# Altium project ((Inventory)).PrjPcb (part 1 of 4)
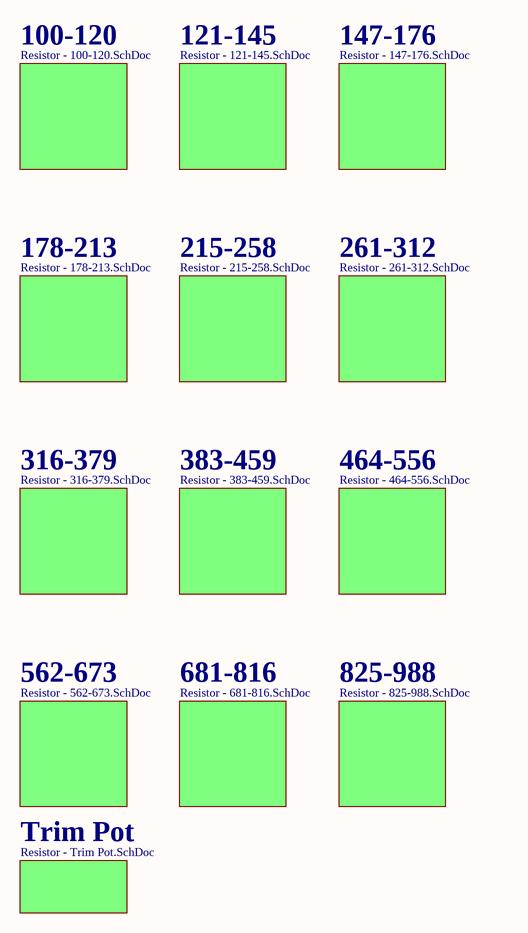
[diagram p0: Resistor.SchDoc]
37 sheets, 84 parts. Net scope: global (net labels, ports and power ports of the same name join across sheets).
Sheets:
  Resistor.SchDoc
    100-120 = Resistor - 100-120.SchDoc
    121-145 = Resistor - 121-145.SchDoc
    147-176 = Resistor - 147-176.SchDoc
    178-213 = Resistor - 178-213.SchDoc
    215-258 = Resistor - 215-258.SchDoc
    261-312 = Resistor - 261-312.SchDoc
    316-379 = Resistor - 316-379.SchDoc
    383-459 = Resistor - 383-459.SchDoc
    464-556 = Resistor - 464-556.SchDoc
    562-673 = Resistor - 562-673.SchDoc
    681-816 = Resistor - 681-816.SchDoc
    825-988 = Resistor - 825-988.SchDoc
    Trim Pot = Resistor - Trim Pot.SchDoc
  Capacitor - Ceramic.SchDoc
  Diode.SchDoc
    Rectifier = Diode - Rectifer.SchDoc
    Zener = Diode - Zener.SchDoc
    Schottky = Diode - Schottky.SchDoc
    TVS = Diode - TVS.SchDoc
    LED = Diode - Led.SchDoc
  Crystal.SchDoc
  Connector.SchDoc
    Header = Connector - Header.SchDoc
    JST = Connector - JST.SchDoc
    Registered Jack = Connector - Registered Jack.SchDoc
    USB = Connector - USB.SchDoc
  Transistor - BJT.SchDoc
  Transformer.SchDoc
  IC - Interface.SchDoc
  IC - MCU.SchDoc
  IC - Power - DC-DC.SchDoc
  IC - Buffer.SchDoc
  IC - Clock, Timing, Oscillator.SchDoc
  Mechanical.SchDoc
  Transistor - Mosfet.SchDoc
  Inductor.SchDoc

## Sheet Resistor.SchDoc
size A; SheetNumber: 1; SheetTotal: 14

### Sub-sheets
100-120 = Resistor - 100-120.SchDoc: no entries
121-145 = Resistor - 121-145.SchDoc: no entries
147-176 = Resistor - 147-176.SchDoc: no entries
178-213 = Resistor - 178-213.SchDoc: no entries
215-258 = Resistor - 215-258.SchDoc: no entries
261-312 = Resistor - 261-312.SchDoc: no entries
316-379 = Resistor - 316-379.SchDoc: no entries
383-459 = Resistor - 383-459.SchDoc: no entries
464-556 = Resistor - 464-556.SchDoc: no entries
562-673 = Resistor - 562-673.SchDoc: no entries
681-816 = Resistor - 681-816.SchDoc: no entries
825-988 = Resistor - 825-988.SchDoc: no entries
Trim Pot = Resistor - Trim Pot.SchDoc: no entries

## Sheet Resistor - 100-120.SchDoc
size A0; SheetNumber: 2; SheetTotal: 41
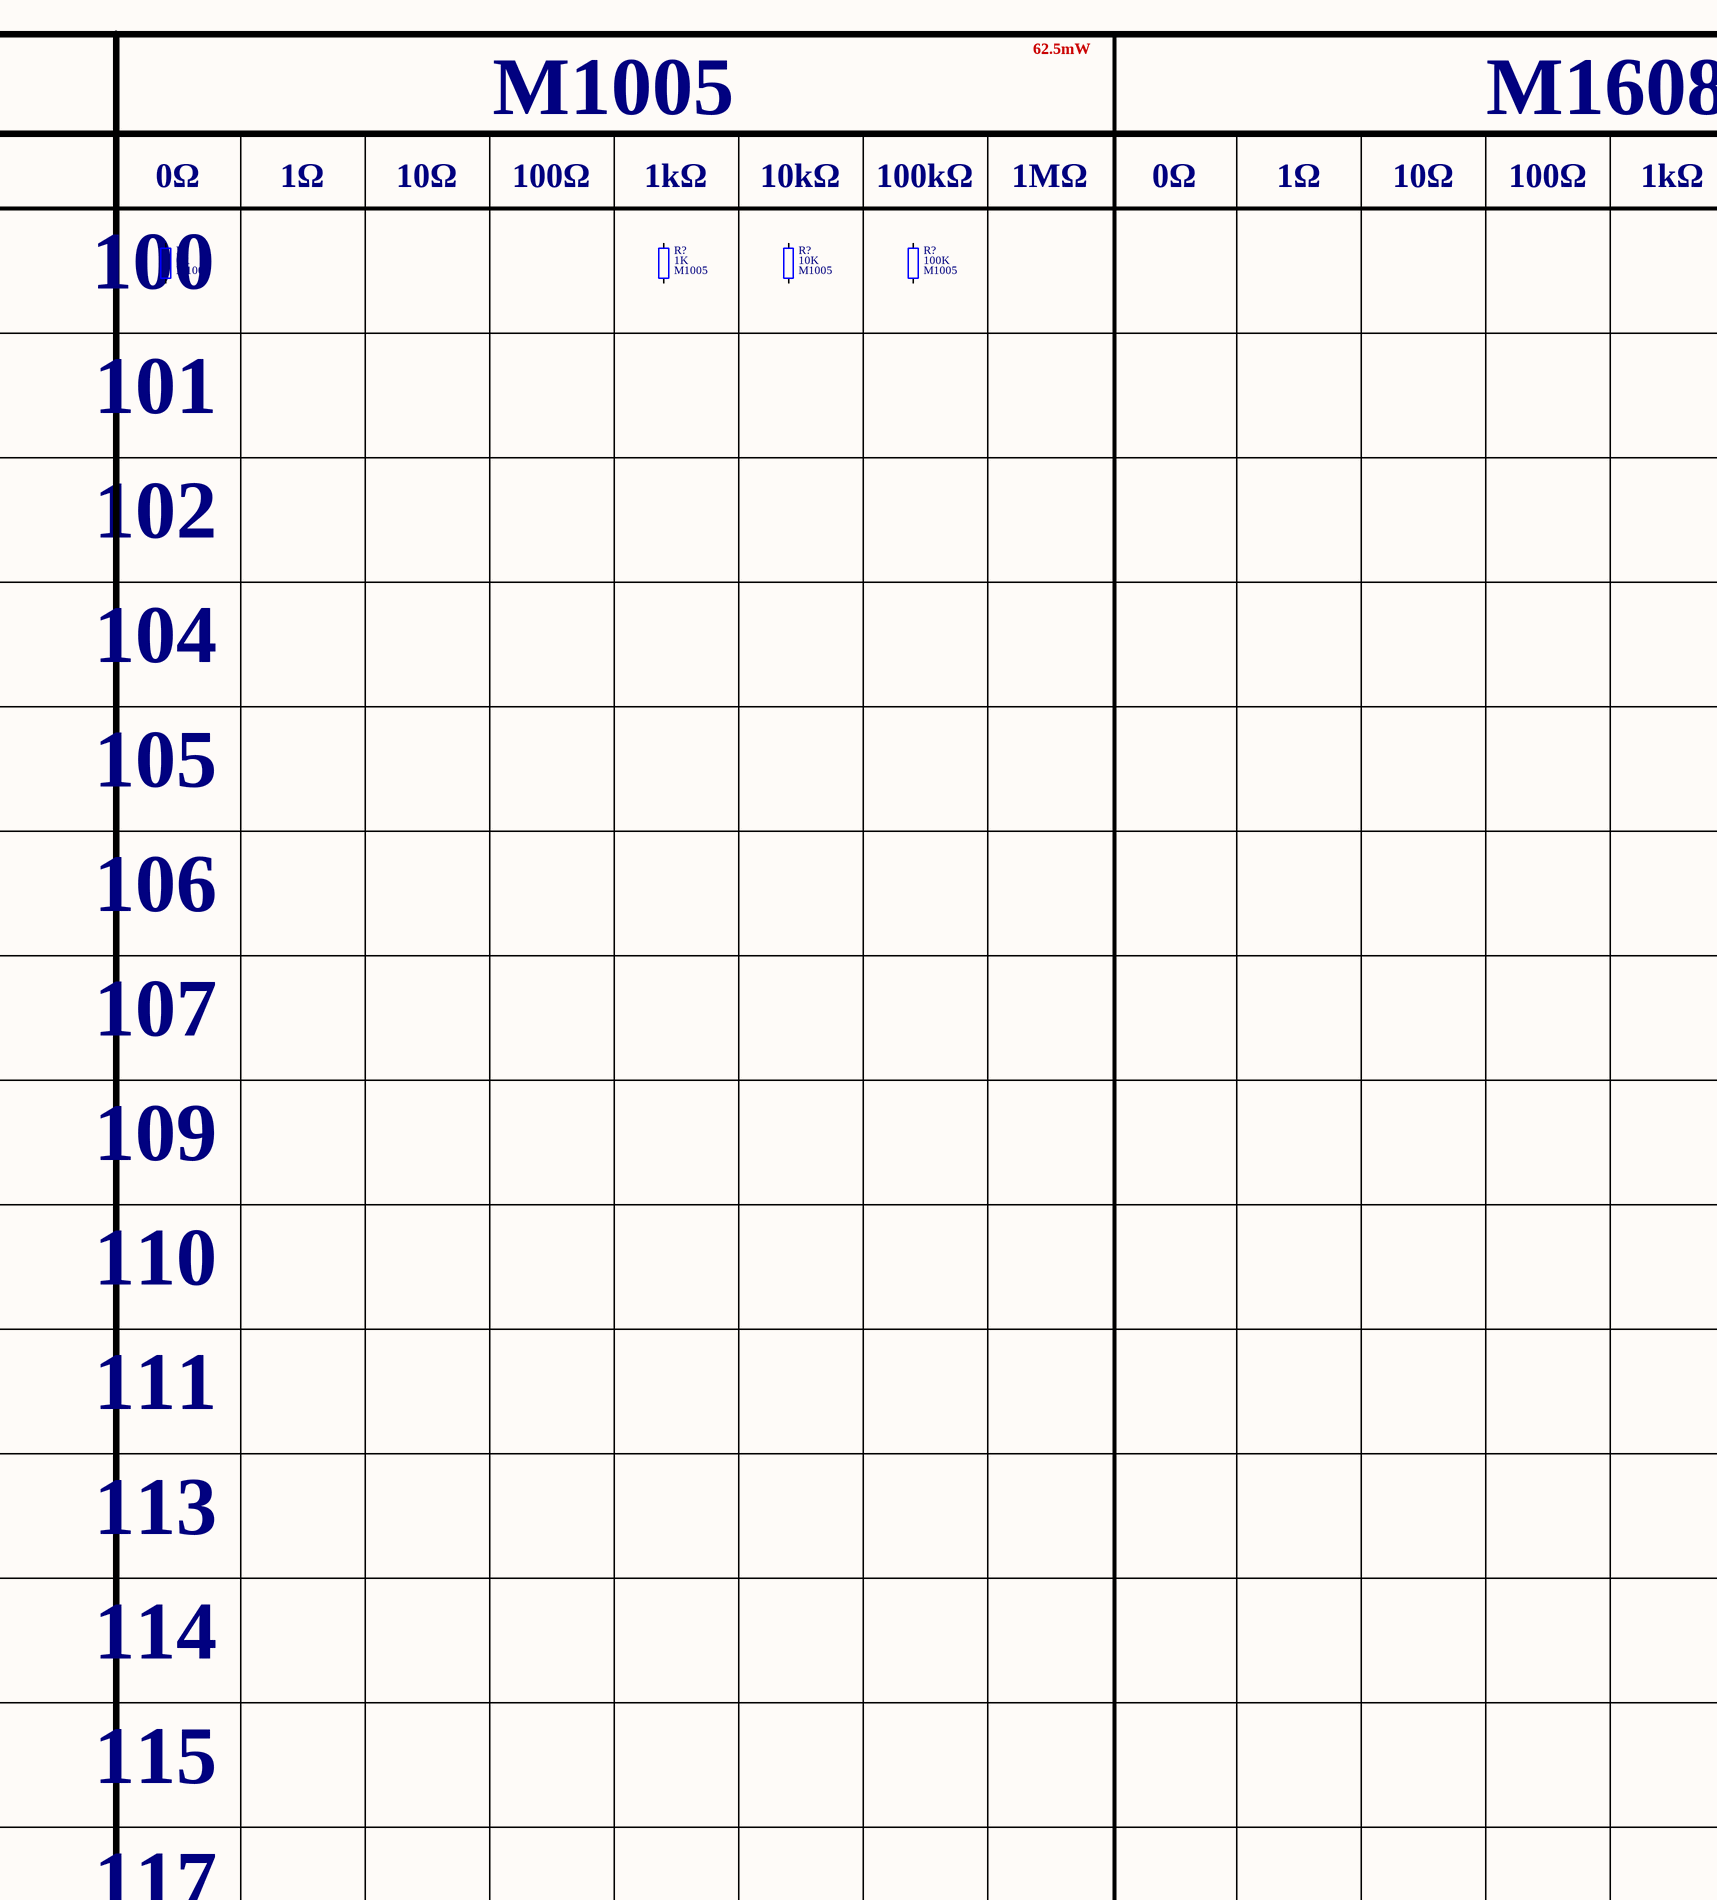
[diagram p1: Resistor - 100-120.SchDoc, top left]
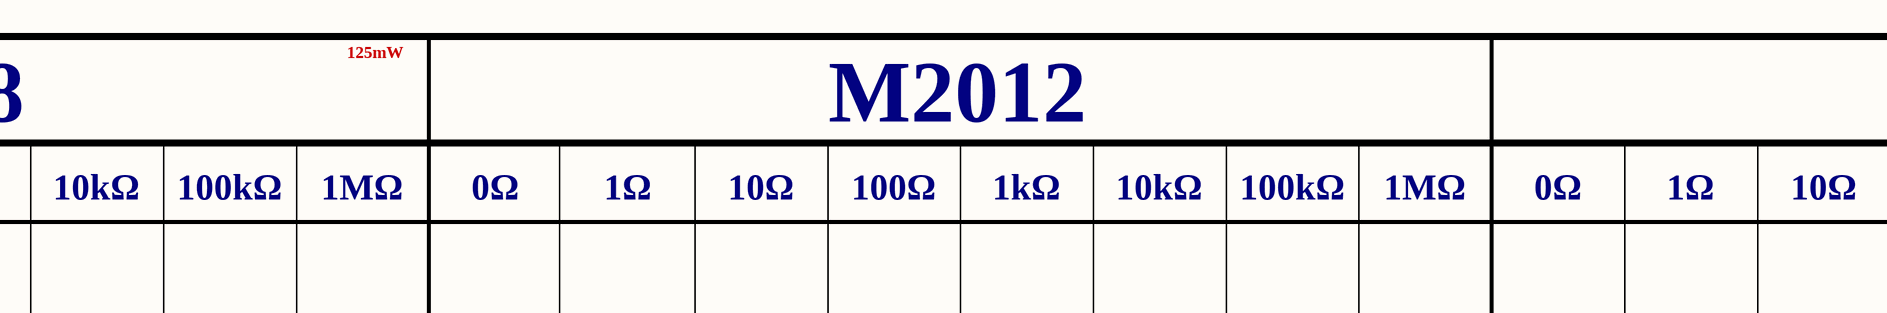
[diagram p2: Resistor - 100-120.SchDoc, top middle]
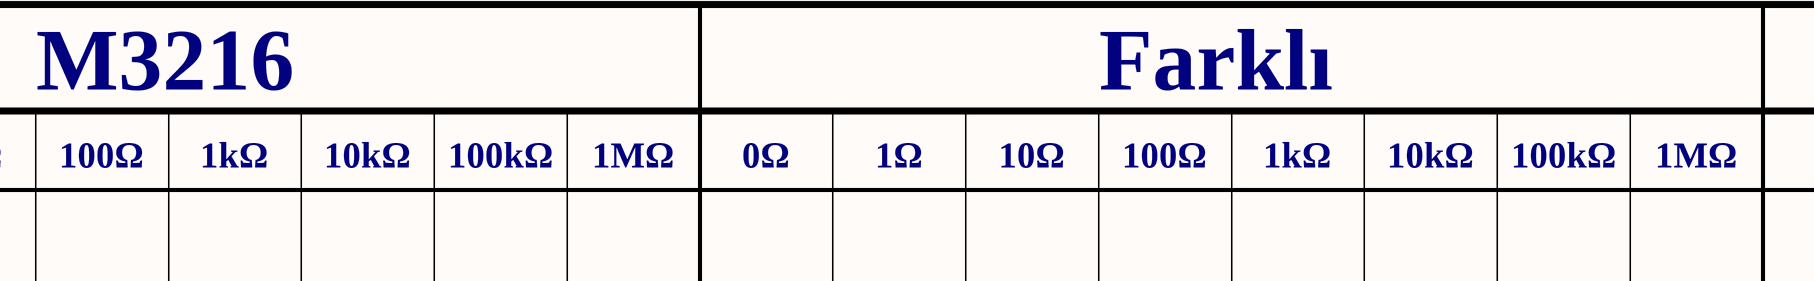
[diagram p3: Resistor - 100-120.SchDoc, top right]
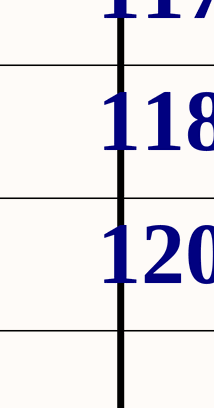
[diagram p4: Resistor - 100-120.SchDoc, bottom left]

### Parts
(Parts that share a designator on the sheet are numbered #1, #2 ... from top to bottom, then left to right.)
R?#1  value 0R  Package: M1005  [Resistor_Smd_M1005_I0402]  (hidden comment: Resistor)
R?#2  value 1K  Package: M1005  [Resistor_Smd_M1005_I0402]  (hidden comment: Resistor)
R?#3  value 10K  Package: M1005  [Resistor_Smd_M1005_I0402]  (hidden comment: Resistor)
R?#4  value 100K  Package: M1005  [Resistor_Smd_M1005_I0402]  (hidden comment: Resistor)

### Nets

Not connected (* = marked no-connect by the designer): R?#1 1 2; R?#2 1 2; R?#3 1 2; R?#4 1 2

### Notes on the sheet
- 62.5mW
- 125mW
- M1005
- M1608
- M2012
- M3216
- Farklı
- 0Ω
- 1Ω
- 10Ω
- 100Ω
- 1kΩ
- 10kΩ
- 100kΩ
- 1MΩ
- 100
- 101
- 102
- 104
- 105
- 106
- 107
- 109
- 110
- 111
- 113
- 114
- 115
- 117
- 118
- 120

### Library data of the parts
R?#1 = Resistor: Res, 0R, M1005; Manufacturer: Yageo; Manufacturer Part Number: RC0402FR-070RL; Component Category: Resistor; Component Type: Fixed Value; Tolerance: *; Supplier Link: https://www.digikey.com/en/products/detail/yageo/RC0402FR-070RL/2827570; Supplier Currency: $; Price, Max: 0.00109; Price, Min: 0.1; Quantity, Max: 50000; Quantity, Min: 1; Operating Temperature, Max: -55℃; Operating Temperature, Min: +155℃; Supplier Part Number: 311-0.0LRCT-ND; Supplier: Digikey; ComponentLink1Description: Datasheet; ComponentLink1URL: E:\Altium\Datasheets\Resistor\Yageo - RC_L Series.pdf; ComponentLink2Description: Supplier Link; ComponentLink2URL: https://www.digikey.com/en/products/detail/yageo/RC0402FR-070RL/2827570
R?#2 = Resistor: Res, 1K, 1%, M1005; Manufacturer: Yageo; Manufacturer Part Number: RC0402FR-071KP; Component Category: Resistor; Component Type: Fixed Value; Tolerance: 1%; Supplier Link: https://www.digikey.com/en/products/detail/yageo/RC0402FR-071KP/4935269; Supplier Currency: $; Price, Max: 0.00282; Price, Min: 0.1; Quantity, Max: 100000; Quantity, Min: 1; Operating Temperature, Max: -55℃; Operating Temperature, Min: +155℃; Supplier Part Number: YAG1254CT-ND; Supplier: Digikey; ComponentLink1Description: Datasheet; ComponentLink1URL: E:\Altium\Datasheets\Resistor\Yageo - RC_L Series.pdf; ComponentLink2Description: Supplier Link; ComponentLink2URL: https://www.digikey.com/en/products/detail/yageo/RC0402FR-071KP/4935269
R?#3 = Resistor: Res, 10K, 1%, M1005; Manufacturer: Yageo; Manufacturer Part Number: RC0402FR-0710KP; Component Category: Resistor; Component Type: Fixed Value; Tolerance: 1%; Supplier Link: https://www.digikey.com/en/products/detail/yageo/RC0402FR-0710KP/4935264; Supplier Currency: $; Price, Max: 0.00282; Price, Min: 0.1; Quantity, Max: 100000; Quantity, Min: 1; Operating Temperature, Max: -55℃; Operating Temperature, Min: +155℃; Supplier Part Number: YAG1249CT-ND; Supplier: Digikey; ComponentLink1Description: Datasheet; ComponentLink1URL: E:\Altium\Datasheets\Resistor\Yageo - RC_L Series.pdf; ComponentLink2Description: Supplier Link; ComponentLink2URL: https://www.digikey.com/en/products/detail/yageo/RC0402FR-0710KP/4935264
R?#4 = Resistor: Res, 100K, 1%, M1005; Manufacturer: Yageo; Manufacturer Part Number: RC0402FR-07100KP; Component Category: Resistor; Component Type: Fixed Value; Tolerance: 1%; Supplier Link: https://www.digikey.com/en/products/detail/yageo/RC0402FR-07100KP/12698883; Supplier Currency: $; Price, Max: 0.00282; Price, Min: 0.1; Quantity, Max: 100000; Quantity, Min: 1; Operating Temperature, Max: -55℃; Operating Temperature, Min: +155℃; Supplier Part Number: 13-RC0402FR-07100KPCT-ND; Supplier: Digikey; ComponentLink1Description: Datasheet; ComponentLink1URL: E:\Altium\Datasheets\Resistor\Yageo - RC_L Series.pdf; ComponentLink2Description: Supplier Link; ComponentLink2URL: https://www.digikey.com/en/products/detail/yageo/RC0402FR-07100KP/12698883

## Sheet Resistor - 121-145.SchDoc
size A0; SheetNumber: 3; SheetTotal: 14
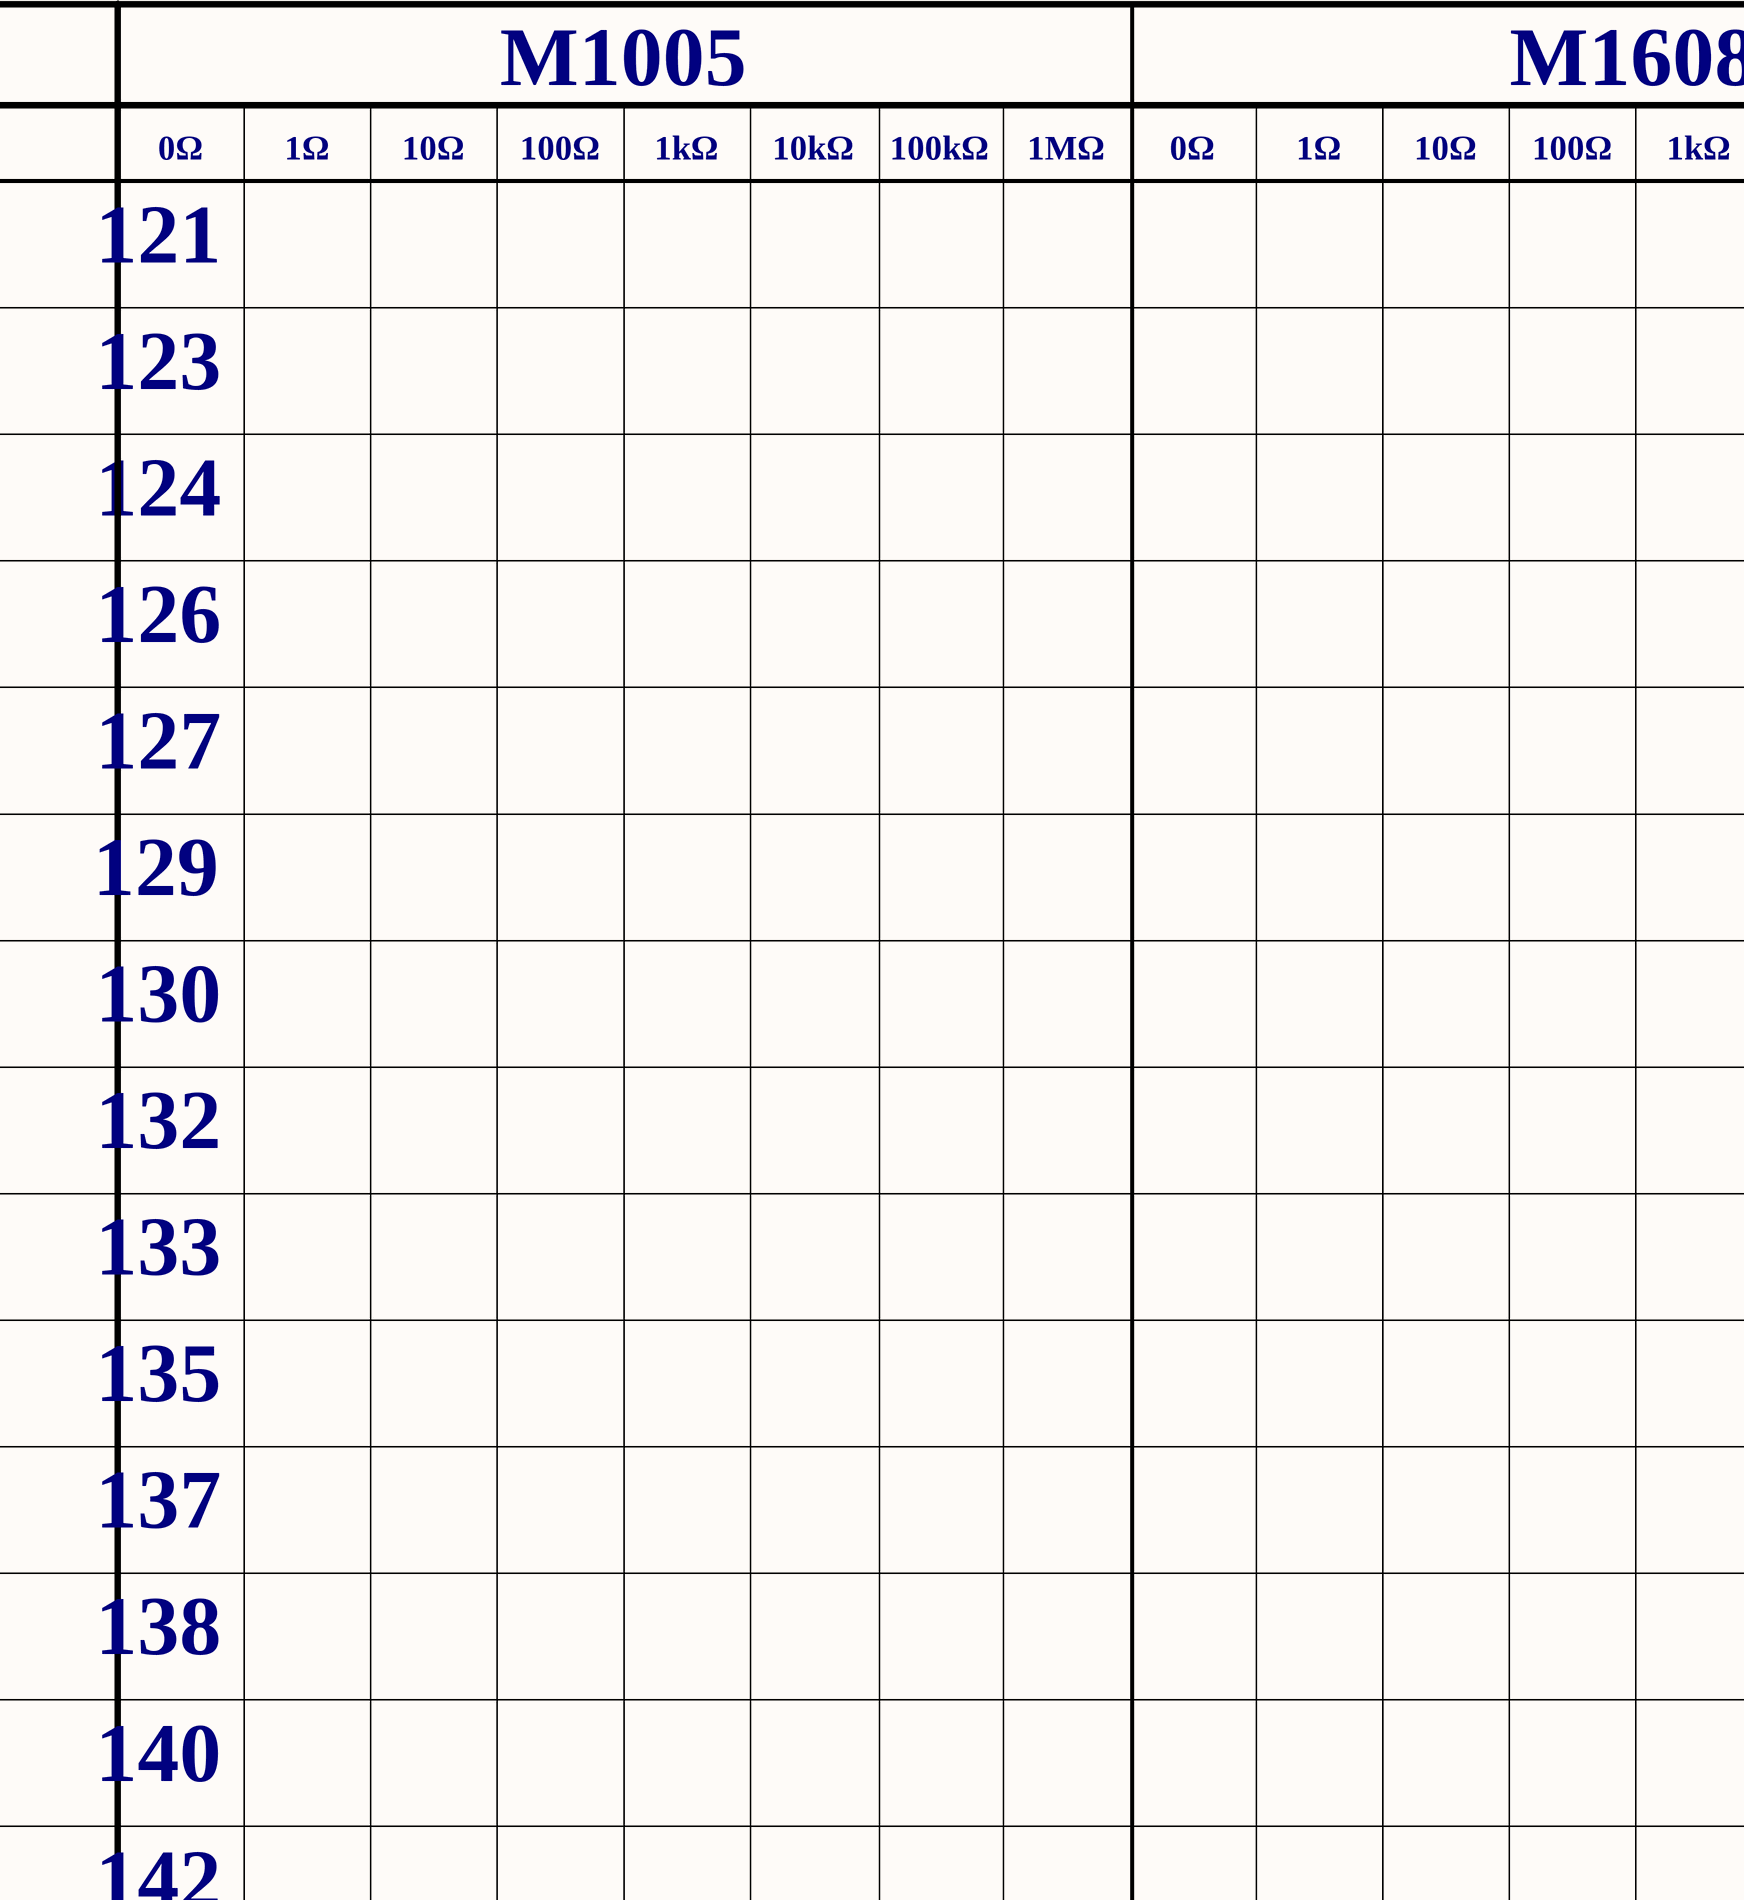
[diagram p5: Resistor - 121-145.SchDoc, top left]
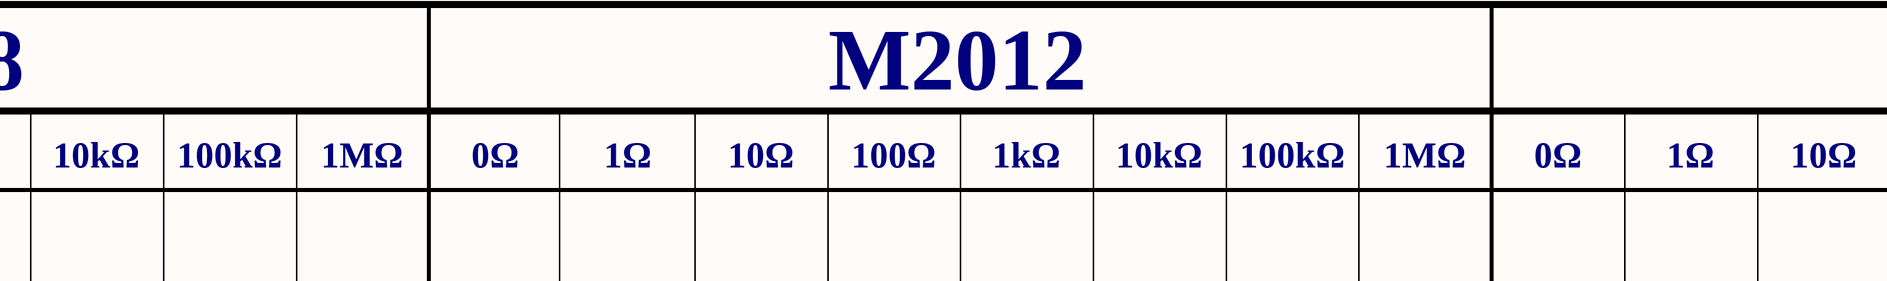
[diagram p6: Resistor - 121-145.SchDoc, top middle]
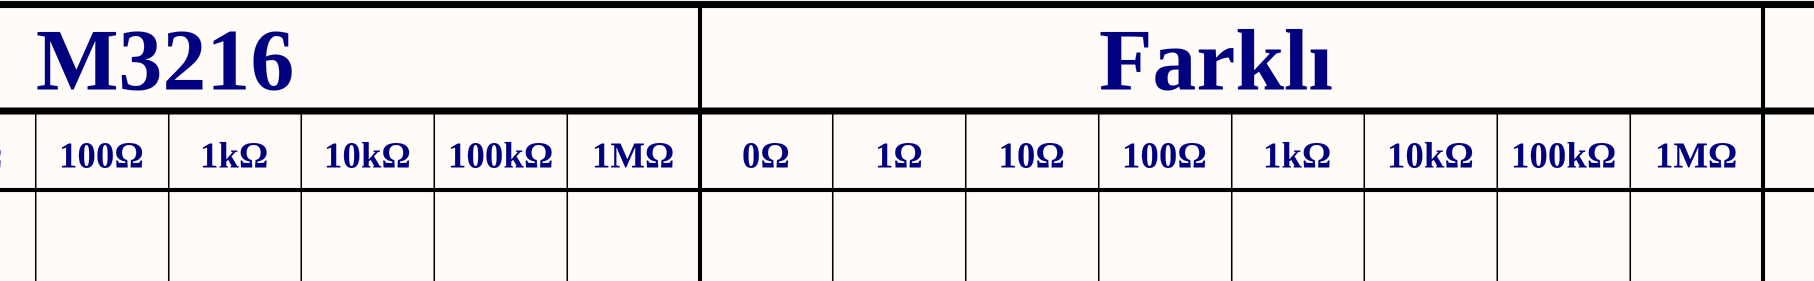
[diagram p7: Resistor - 121-145.SchDoc, top right]
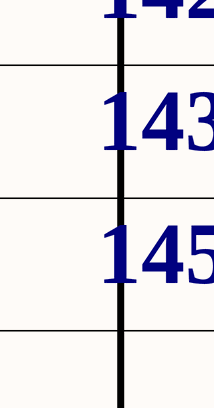
[diagram p8: Resistor - 121-145.SchDoc, bottom left]

### Notes on the sheet
- M1005
- M1608
- M2012
- M3216
- Farklı
- 0Ω
- 1Ω
- 10Ω
- 100Ω
- 1kΩ
- 10kΩ
- 100kΩ
- 1MΩ
- 121
- 123
- 124
- 126
- 127
- 129
- 130
- 132
- 133
- 135
- 137
- 138
- 140
- 142
- 143
- 145

## Sheet Resistor - 147-176.SchDoc
size A0; SheetNumber: 4; SheetTotal: 41
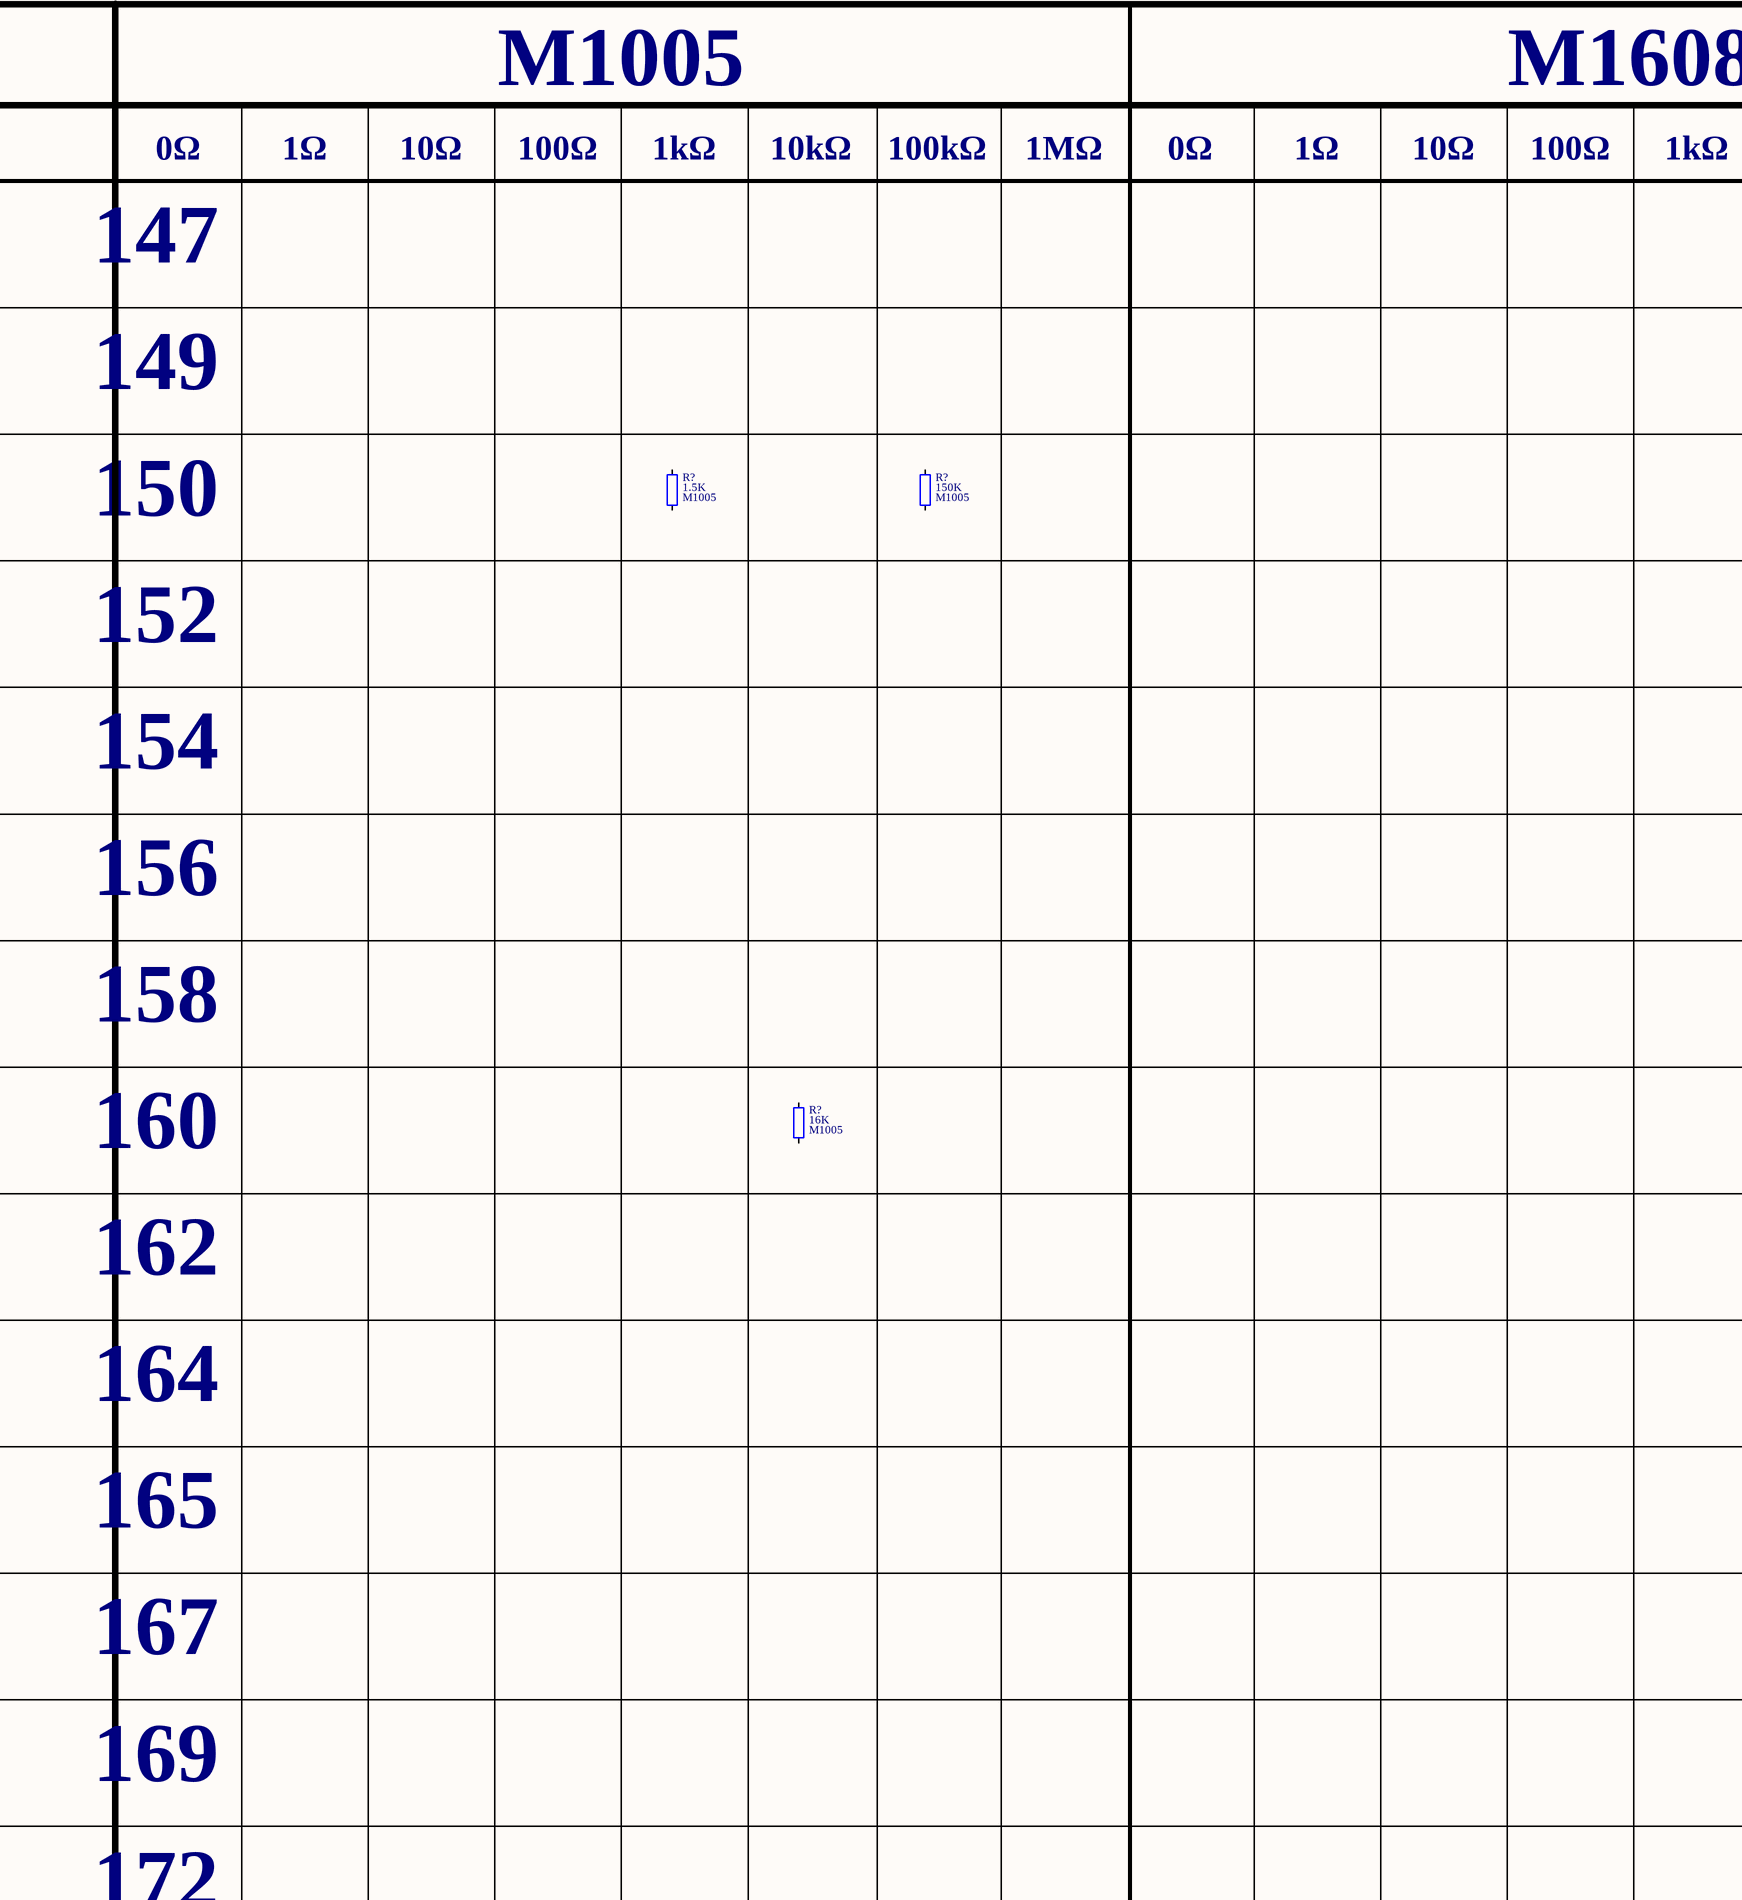
[diagram p9: Resistor - 147-176.SchDoc, top left]
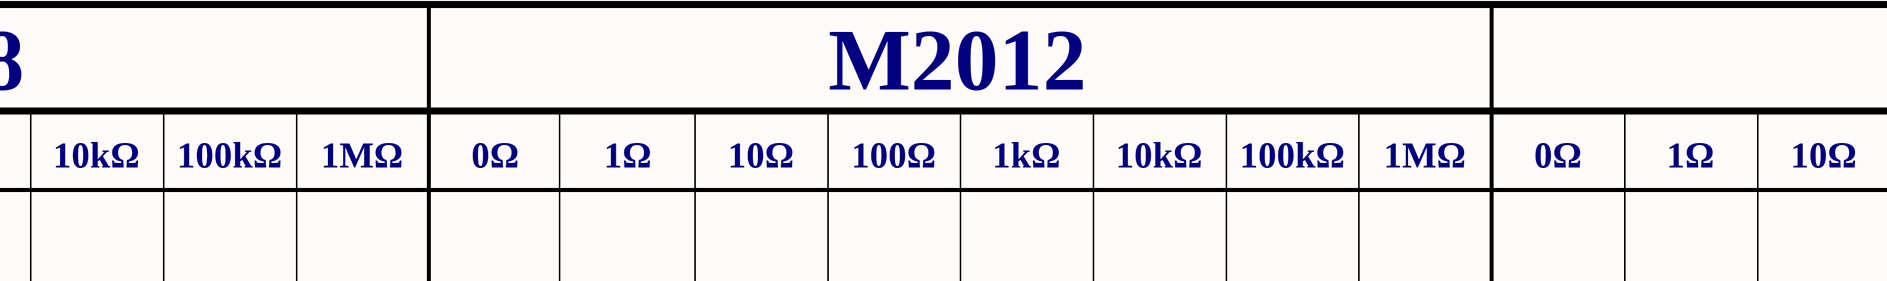
[diagram p10: Resistor - 147-176.SchDoc, top middle]
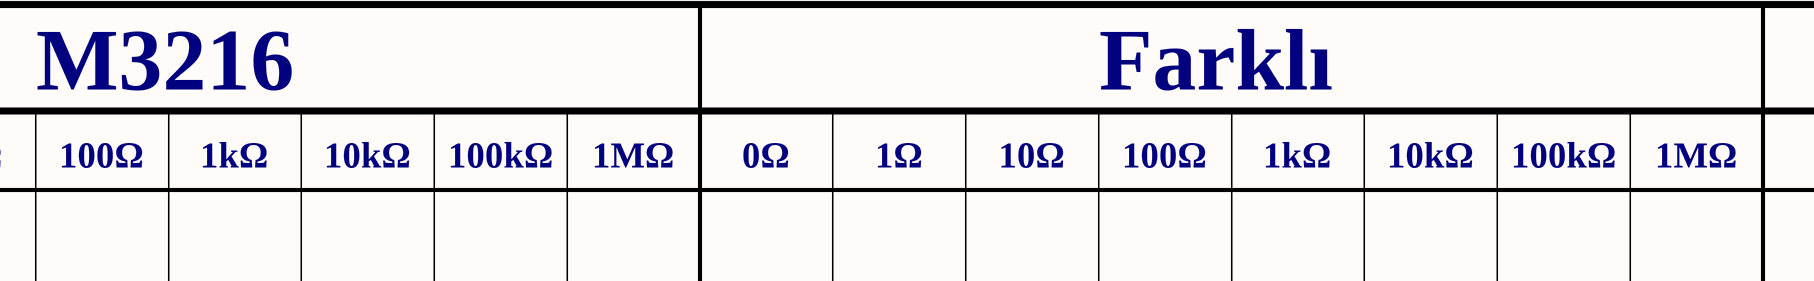
[diagram p11: Resistor - 147-176.SchDoc, top right]
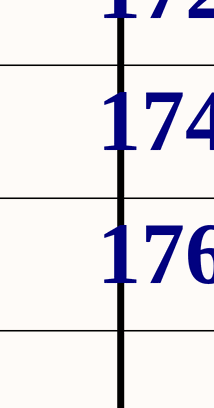
[diagram p12: Resistor - 147-176.SchDoc, bottom left]

### Parts
(Parts that share a designator on the sheet are numbered #1, #2 ... from top to bottom, then left to right.)
R?#5  value 1.5K  Package: M1005  [Resistor_Smd_M1005_I0402]  (hidden comment: Resistor)
R?#6  value 150K  Package: M1005  [Resistor_Smd_M1005_I0402]  (hidden comment: Resistor)
R?#7  value 16K  Package: M1005  [Resistor_Smd_M1005_I0402]  (hidden comment: Resistor)

### Nets

Not connected (* = marked no-connect by the designer): R?#5 1 2; R?#6 1 2; R?#7 1 2

### Notes on the sheet
- M1005
- M1608
- M2012
- M3216
- Farklı
- 0Ω
- 1Ω
- 10Ω
- 100Ω
- 1kΩ
- 10kΩ
- 100kΩ
- 1MΩ
- 147
- 149
- 150
- 152
- 154
- 156
- 158
- 160
- 162
- 164
- 165
- 167
- 169
- 172
- 174
- 176

### Library data of the parts
R?#5 = Resistor: Res, 1.5K, 1%, M1005; Manufacturer: Yageo; Manufacturer Part Number: RC0402FR-071K5L; Component Category: Resistor; Component Type: Fixed Value; Tolerance: 1%; Supplier Link: https://www.digikey.com/en/products/detail/yageo/RC0402FR-071K5L/726519; Supplier Currency: $; Price, Max: 0.00129; Price, Min: 0.1; Quantity, Max: 100000; Quantity, Min: 1; Operating Temperature, Max: -55℃; Operating Temperature, Min: +155℃; Supplier Part Number: 311-1.50KLRCT-ND; Supplier: Digikey; ComponentLink1Description: Datasheet; ComponentLink1URL: E:\Altium\Datasheets\Resistor\Yageo - RC_L Series.pdf; ComponentLink2Description: Supplier Link; ComponentLink2URL: https://www.digikey.com/en/products/detail/yageo/RC0402FR-071K5L/726519
R?#6 = Resistor: Res, 150K, 1%, M1005; Manufacturer: Yageo; Manufacturer Part Number: RC0402FR-07150KL; Component Category: Resistor; Component Type: Fixed Value; Tolerance: 1%; Supplier Link: https://www.digikey.com/en/products/detail/yageo/RC0402FR-07150KL/726542; Supplier Currency: $; Price, Max: 0.00129; Price, Min: 0.1; Quantity, Max: 100000; Quantity, Min: 1; Operating Temperature, Max: -55℃; Operating Temperature, Min: +155℃; Supplier Part Number: 311-150KLRCT-ND; Supplier: Digikey; ComponentLink1Description: Datasheet; ComponentLink1URL: E:\Altium\Datasheets\Resistor\Yageo - RC_L Series.pdf; ComponentLink2Description: Supplier Link; ComponentLink2URL: https://www.digikey.com/en/products/detail/yageo/RC0402FR-07150KL/726542
R?#7 = Resistor: Res, 16K, 1%, M1005; Manufacturer: Yageo; Manufacturer Part Number: RC0402FR-0716KL; Component Category: Resistor; Component Type: Fixed Value; Tolerance: 1%; Supplier Link: https://www.digikey.com/en/products/detail/yageo/RC0402FR-0716KL/726544; Supplier Currency: $; Price, Max: 0.00129; Price, Min: 0.1; Quantity, Max: 100000; Quantity, Min: 1; Operating Temperature, Max: -55℃; Operating Temperature, Min: +155℃; Supplier Part Number: 311-16.0KLRCT-ND; Supplier: Digikey; ComponentLink1Description: Datasheet; ComponentLink1URL: E:\Altium\Datasheets\Resistor\Yageo - RC_L Series.pdf; ComponentLink2Description: Supplier Link; ComponentLink2URL: https://www.digikey.com/en/products/detail/yageo/RC0402FR-0716KL/726544

## Sheet Resistor - 178-213.SchDoc
size A0; SheetNumber: 5; SheetTotal: 41
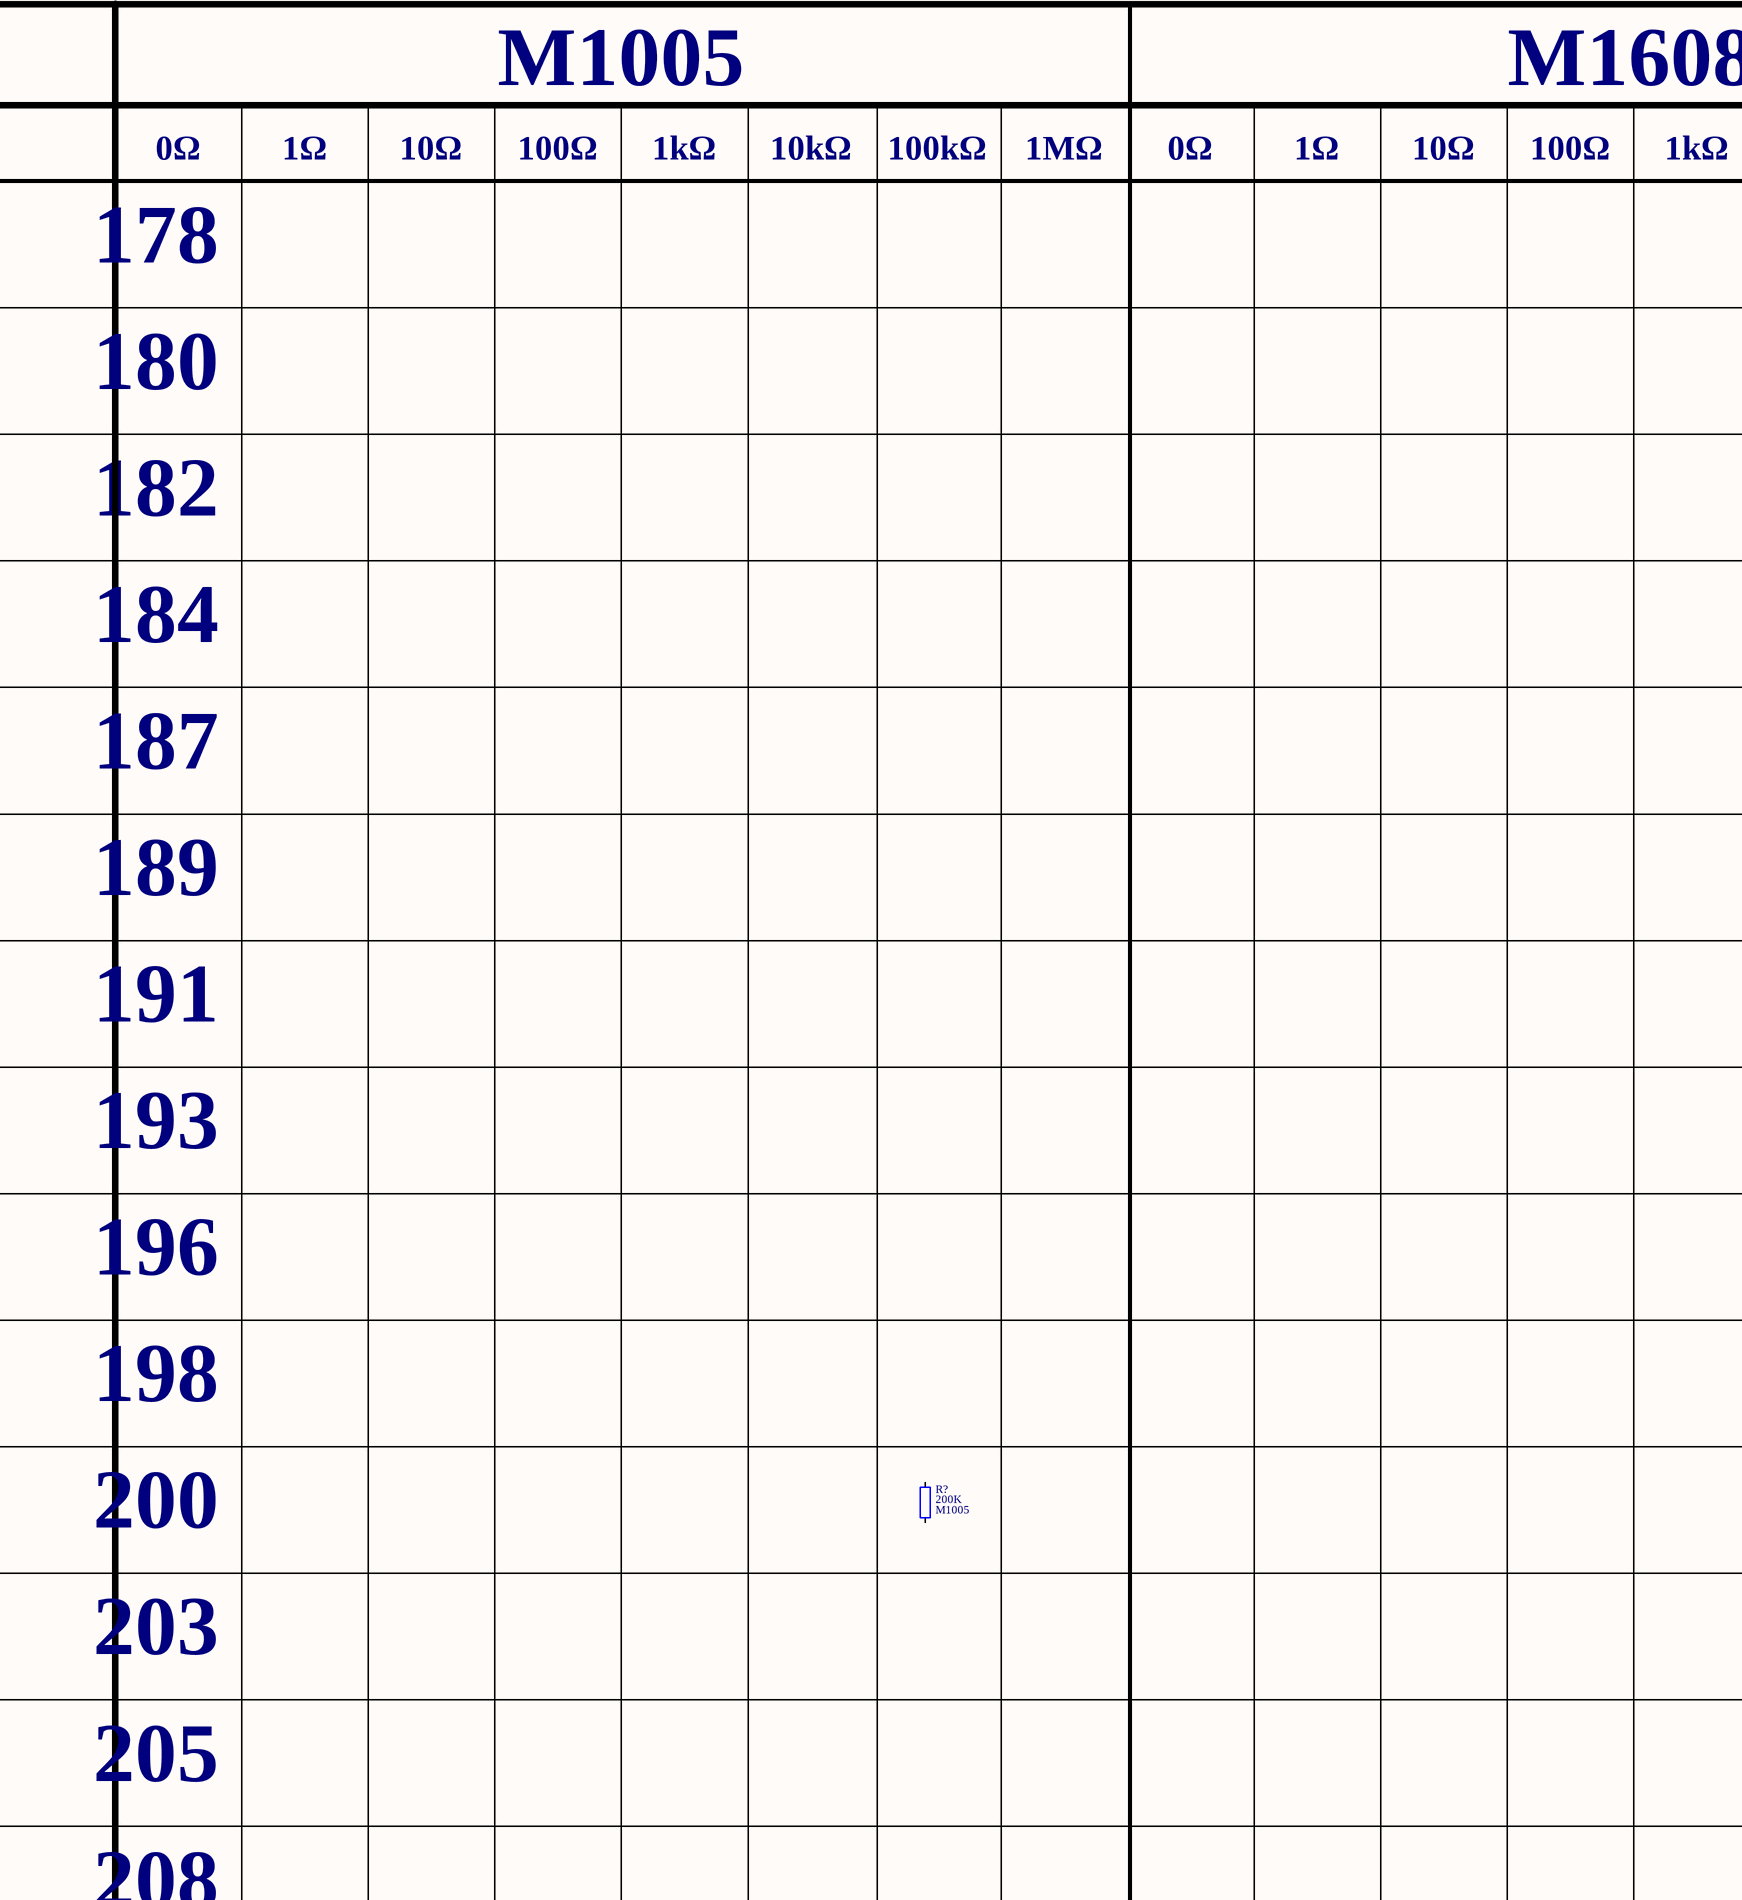
[diagram p13: Resistor - 178-213.SchDoc, top left]
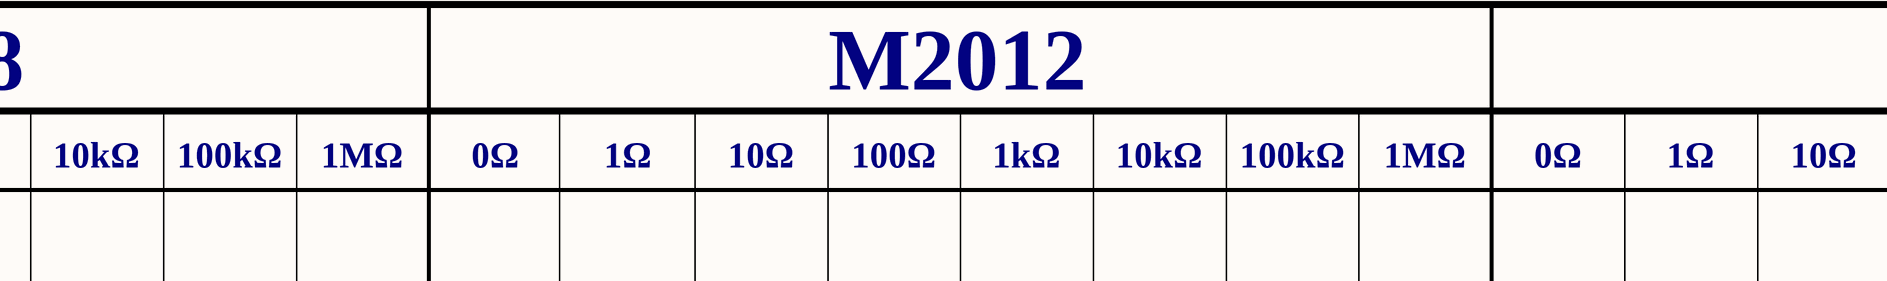
[diagram p14: Resistor - 178-213.SchDoc, top middle]
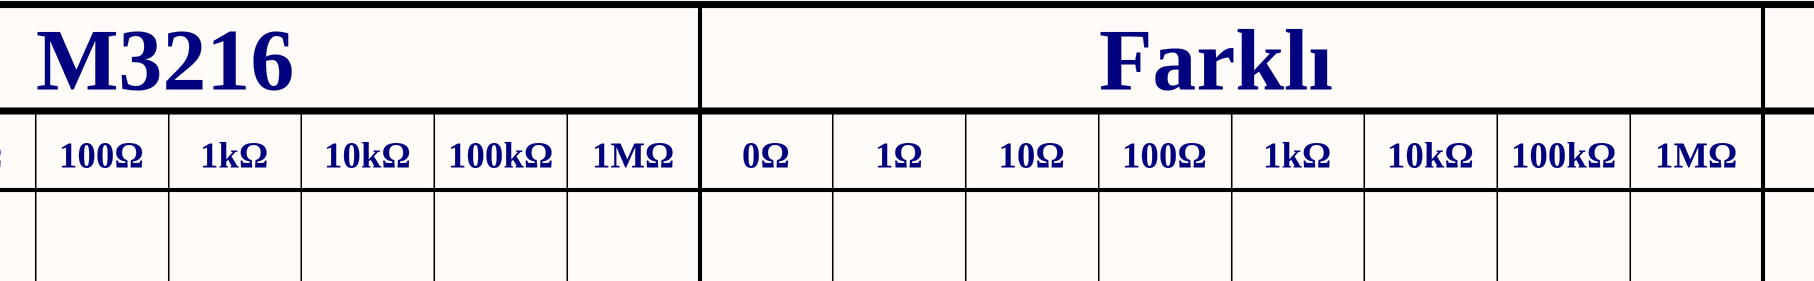
[diagram p15: Resistor - 178-213.SchDoc, top right]
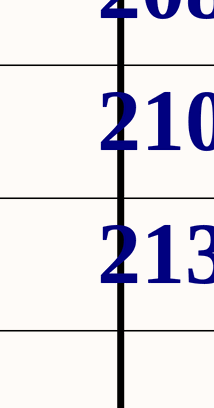
[diagram p16: Resistor - 178-213.SchDoc, bottom left]

### Parts
(Parts that share a designator on the sheet are numbered #1, #2 ... from top to bottom, then left to right.)
R?#8  value 200K  Package: M1005  [Resistor_Smd_M1005_I0402]  (hidden comment: Resistor)

### Nets

Not connected (* = marked no-connect by the designer): R?#8 1 2

### Notes on the sheet
- M1005
- M1608
- M2012
- M3216
- Farklı
- 0Ω
- 1Ω
- 10Ω
- 100Ω
- 1kΩ
- 10kΩ
- 100kΩ
- 1MΩ
- 178
- 180
- 182
- 184
- 187
- 189
- 191
- 193
- 196
- 198
- 200
- 203
- 205
- 208
- 210
- 213

### Library data of the parts
R?#8 = Resistor: Res, 200K, 1%, M1005; Manufacturer: Yageo; Manufacturer Part Number: RC0402FR-07200KL; Component Category: Resistor; Component Type: Fixed Value; Tolerance: 1%; Supplier Link: https://www.digikey.com/en/products/detail/yageo/RC0402FR-07200KL/726558; Supplier Currency: $; Price, Max: 0.00129; Price, Min: 0.1; Quantity, Max: 100000; Quantity, Min: 1; Operating Temperature, Max: -55℃; Operating Temperature, Min: +155℃; Supplier Part Number: 311-200KLRCT-ND; Supplier: Digikey; ComponentLink1Description: Datasheet; ComponentLink1URL: E:\Altium\Datasheets\Resistor\Yageo - RC_L Series.pdf; ComponentLink2Description: Supplier Link; ComponentLink2URL: https://www.digikey.com/en/products/detail/yageo/RC0402FR-07200KL/726558

## Sheet Resistor - 215-258.SchDoc
size A0; SheetNumber: 6; SheetTotal: 41
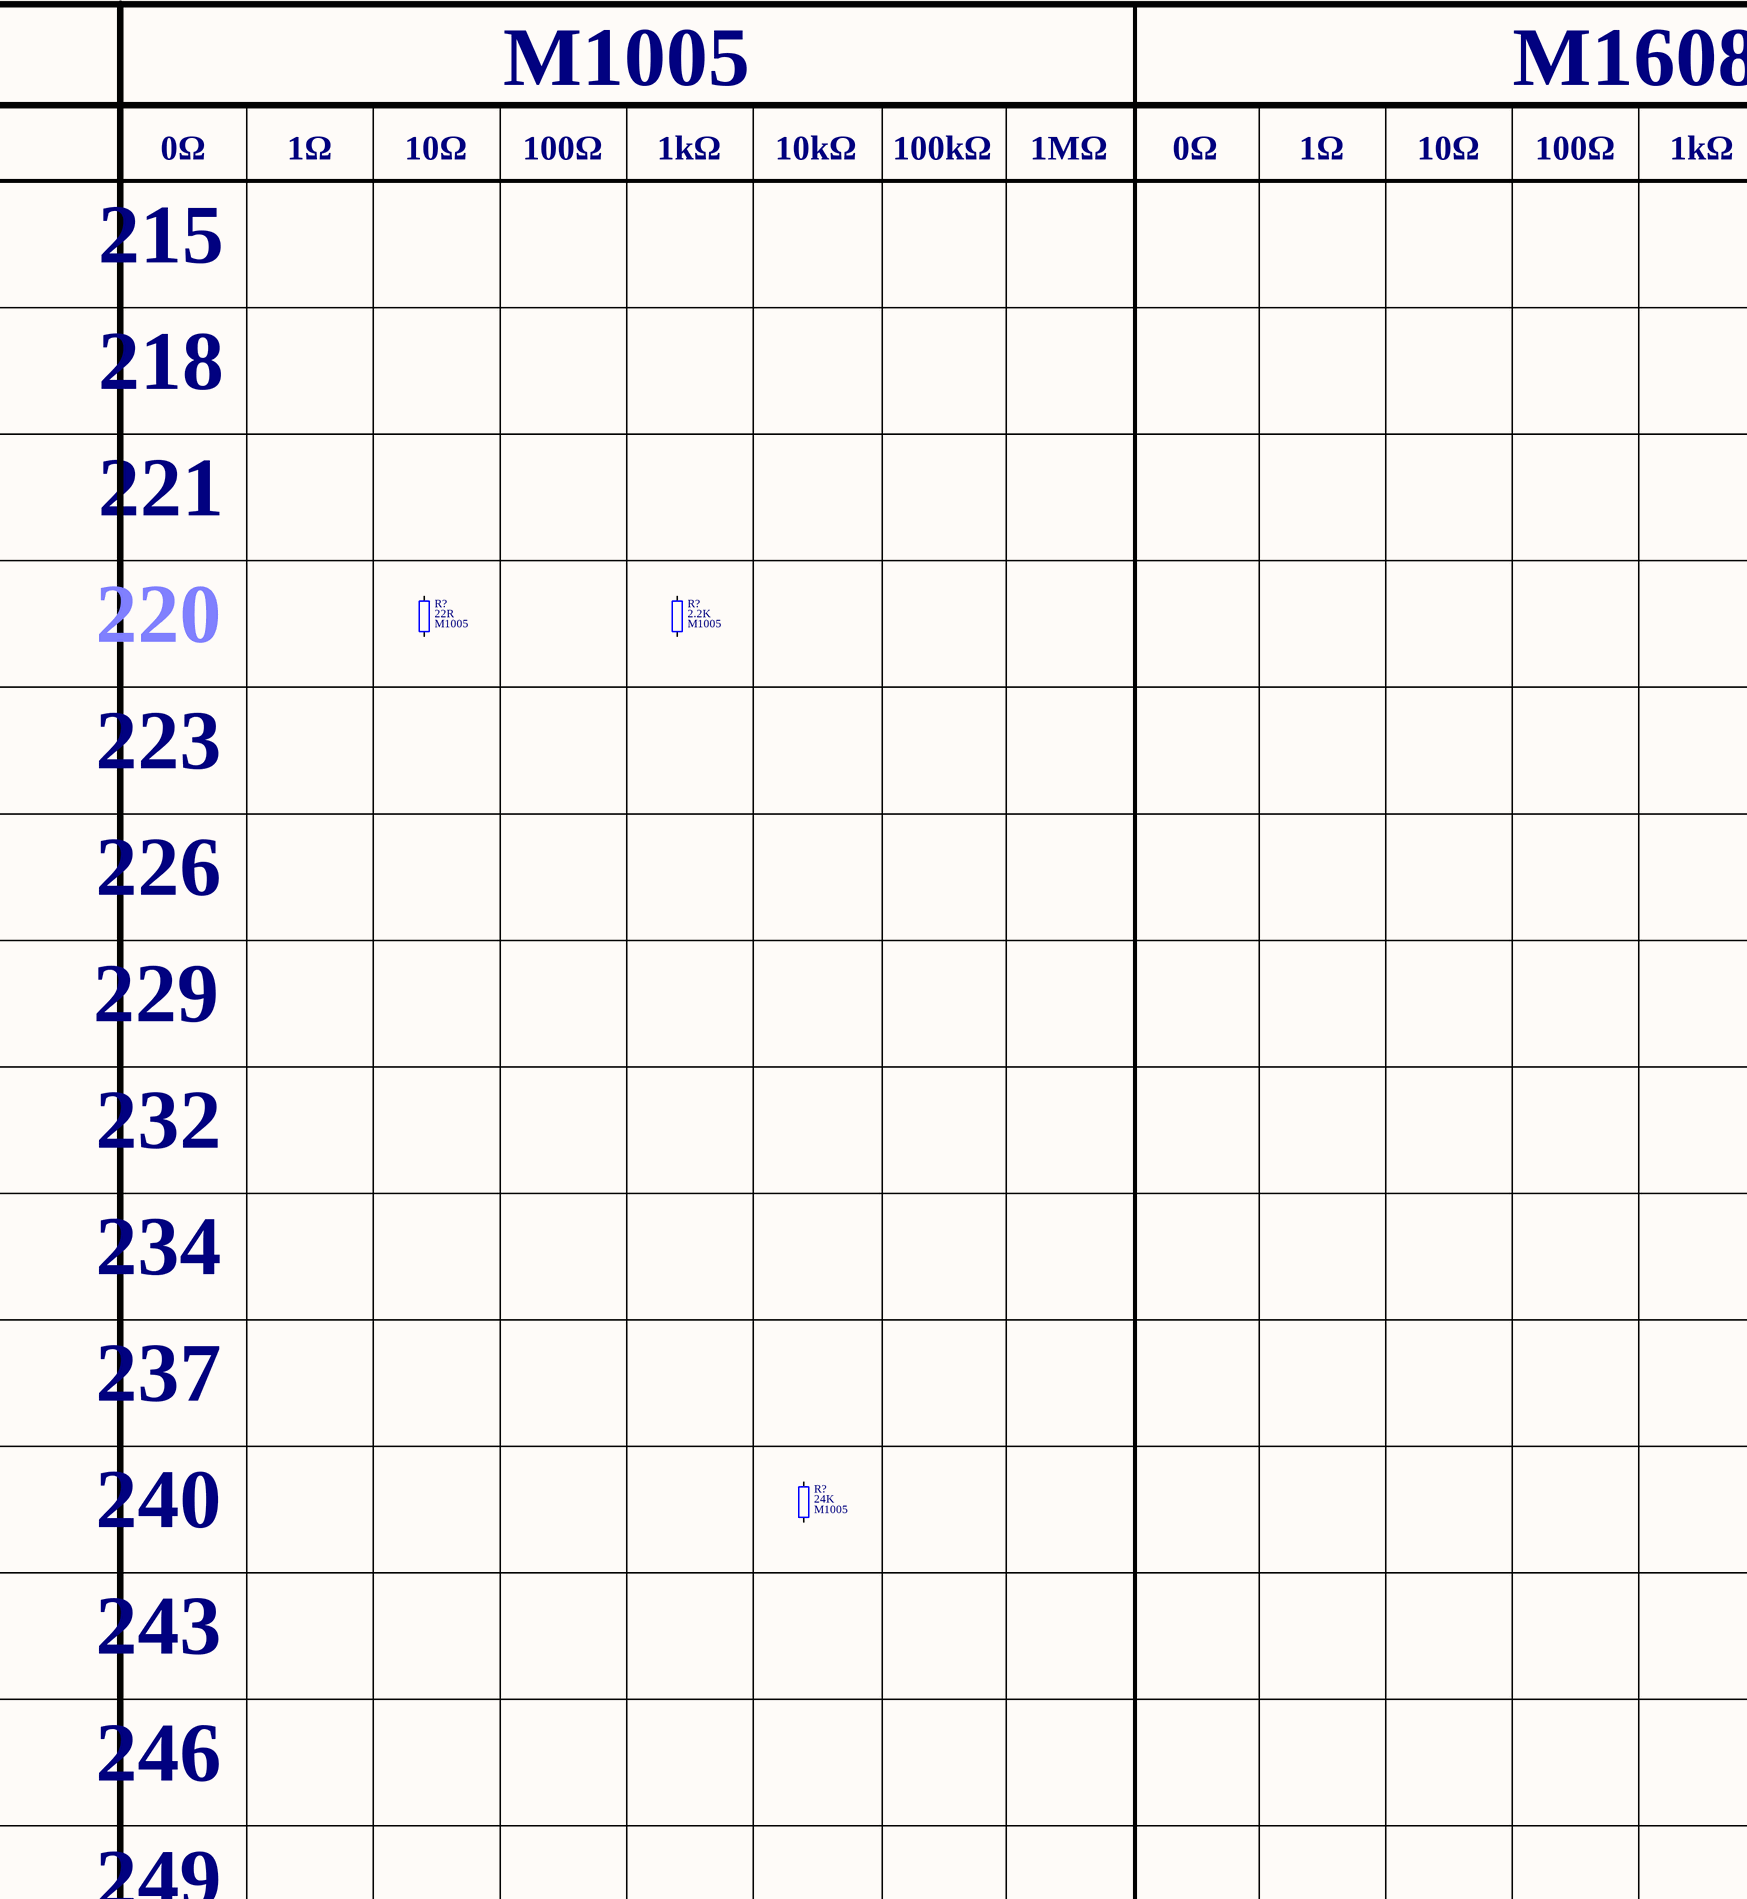
[diagram p17: Resistor - 215-258.SchDoc, top left]
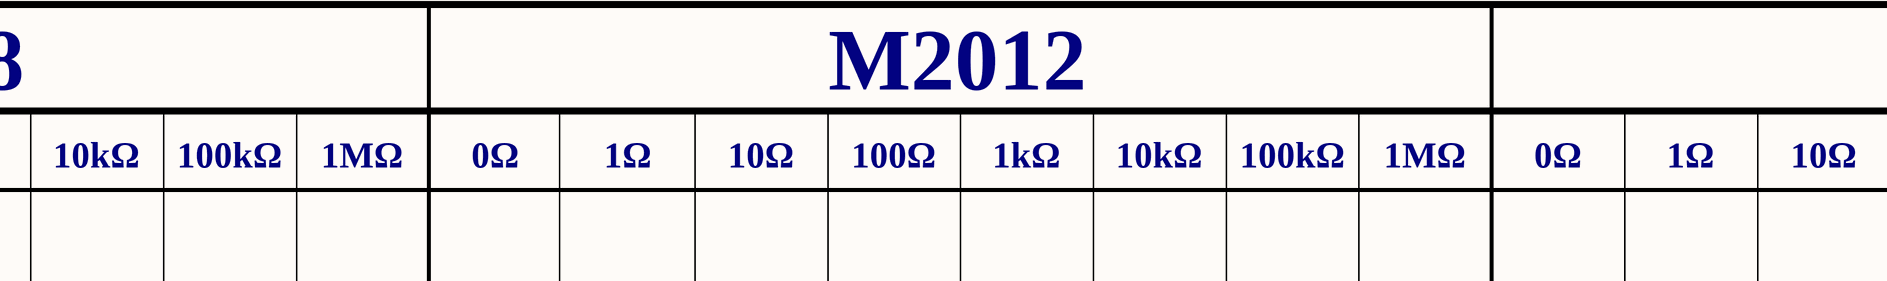
[diagram p18: Resistor - 215-258.SchDoc, top middle]
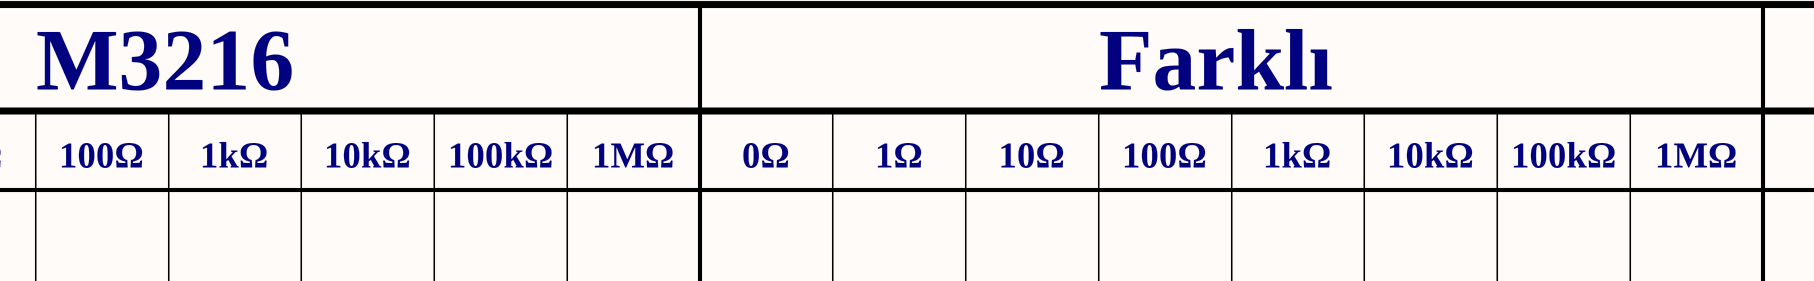
[diagram p19: Resistor - 215-258.SchDoc, top right]
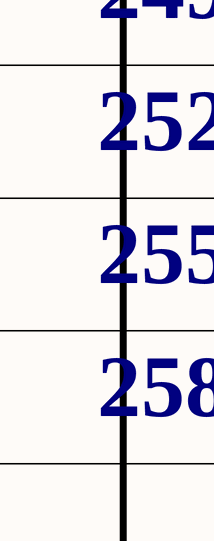
[diagram p20: Resistor - 215-258.SchDoc, bottom left]

### Parts
(Parts that share a designator on the sheet are numbered #1, #2 ... from top to bottom, then left to right.)
R?#9  value 22R  Package: M1005  [Resistor_Smd_M1005_I0402]  (hidden comment: Resistor)
R?#10  value 2.2K  Package: M1005  [Resistor_Smd_M1005_I0402]  (hidden comment: Resistor)
R?#11  value 24K  Package: M1005  [Resistor_Smd_M1005_I0402]  (hidden comment: Resistor)

### Nets

Not connected (* = marked no-connect by the designer): R?#9 1 2; R?#10 1 2; R?#11 1 2

### Notes on the sheet
- M1005
- M1608
- M2012
- M3216
- Farklı
- 0Ω
- 1Ω
- 10Ω
- 100Ω
- 1kΩ
- 10kΩ
- 100kΩ
- 1MΩ
- 215
- 218
- 221
- 220
- 223
- 226
- 229
- 232
- 234
- 237
- 240
- 243
- 246
- 249
- 252
- 255
- 258

### Library data of the parts
R?#9 = Resistor: Res, 22R, 1%, M1005; Manufacturer: Yageo; Manufacturer Part Number: RC0402FR-0722RL; Component Category: Resistor; Component Type: Fixed Value; Tolerance: 1%; Supplier Link: https://www.digikey.com/en/products/detail/yageo/RC0402FR-0722RL/726562; Supplier Currency: $; Price, Max: 0.00129; Price, Min: 0.1; Quantity, Max: 100000; Quantity, Min: 1; Operating Temperature, Max: -55℃; Operating Temperature, Min: +155℃; Supplier Part Number: 311-22.0LRCT-ND; Supplier: Digikey; ComponentLink1Description: Datasheet; ComponentLink1URL: E:\Altium\Datasheets\Resistor\Yageo - RC_L Series.pdf; ComponentLink2Description: Supplier Link; ComponentLink2URL: https://www.digikey.com/en/products/detail/yageo/RC0402FR-0722RL/726562
R?#10 = Resistor: Res, 2.2K, 1%, M1005; Manufacturer: Yageo; Manufacturer Part Number: RC0402FR-072K2L; Component Category: Resistor; Component Type: Fixed Value; Tolerance: 1%; Supplier Link: https://www.digikey.com/en/products/detail/yageo/RC0402FR-072K2L/726553; Supplier Currency: $; Price, Max: 0.00129; Price, Min: 0.1; Quantity, Max: 100000; Quantity, Min: 1; Operating Temperature, Max: -55℃; Operating Temperature, Min: +155℃; Supplier Part Number: 311-2.20KLRCT-ND; Supplier: Digikey; ComponentLink1Description: Datasheet; ComponentLink1URL: E:\Altium\Datasheets\Resistor\Yageo - RC_L Series.pdf; ComponentLink2Description: Supplier Link; ComponentLink2URL: https://www.digikey.com/en/products/detail/yageo/RC0402FR-072K2L/726553
R?#11 = Resistor: Res, 24K, 1%, M1005; Manufacturer: Yageo; Manufacturer Part Number: RC0402FR-0724KL; Component Category: Resistor; Component Type: Fixed Value; Tolerance: 1%; Supplier Link: https://www.digikey.com/en/products/detail/yageo/RC0402FR-0724KL/2827581; Supplier Currency: $; Price, Max: 0.00129; Price, Min: 0.1; Quantity, Max: 100000; Quantity, Min: 1; Operating Temperature, Max: -55℃; Operating Temperature, Min: +155℃; Supplier Part Number: 311-24KLRCT-ND; Supplier: Digikey; ComponentLink1Description: Datasheet; ComponentLink1URL: E:\Altium\Datasheets\Resistor\Yageo - RC_L Series.pdf; ComponentLink2Description: Supplier Link; ComponentLink2URL: https://www.digikey.com/en/products/detail/yageo/RC0402FR-0724KL/2827581